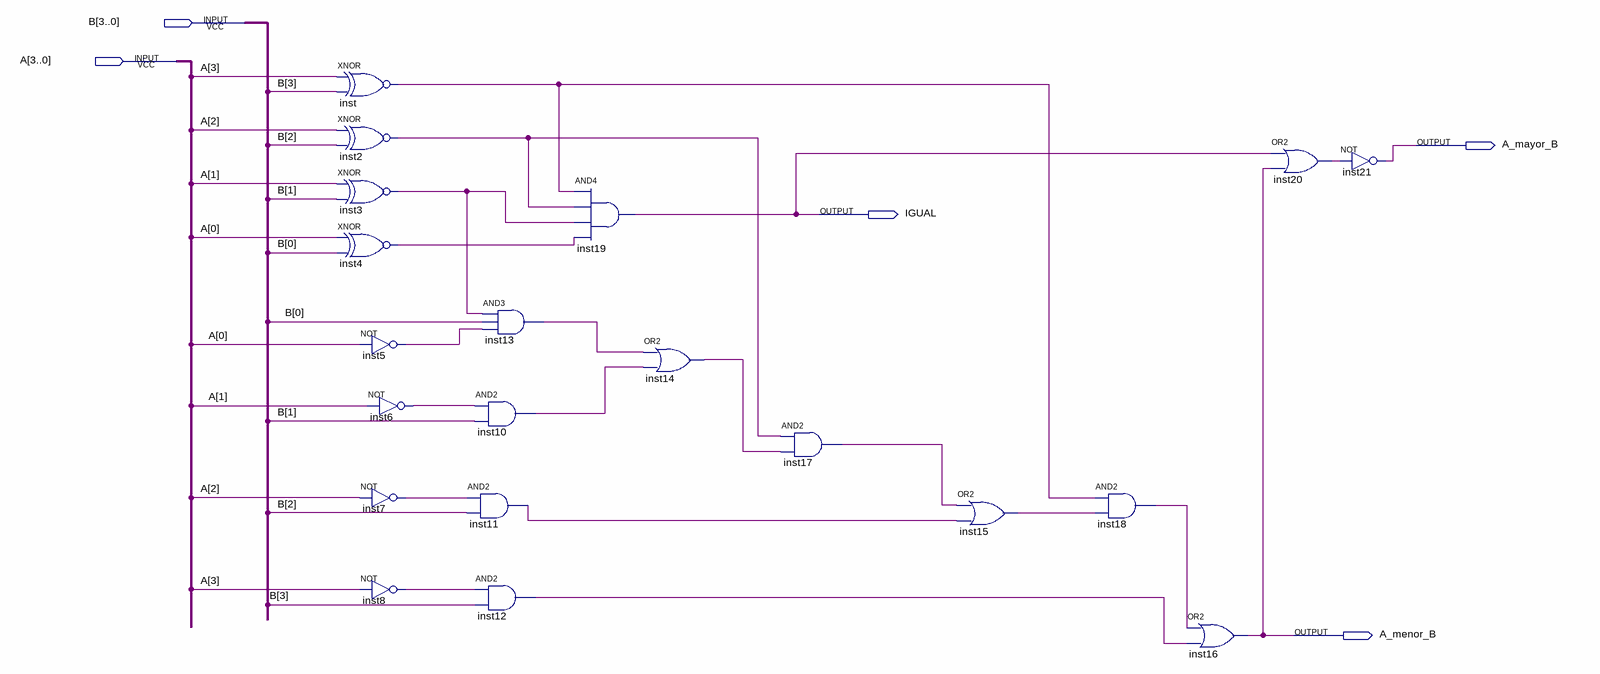
[diagram p0: schematic sheet]
// Quartus schematic Comp_1B.bdf as structural Verilog: 20 symbols, 5 pins
module Comp_1B (
  input  [3:0] B,
  input  [3:0] A,
  output A_mayor_B,
  output IGUAL,
  output A_menor_B
);

  wire inst2_out, inst3_out, inst4_out, inst5_out, inst6_out, inst7_out, inst8_out, inst10_out, inst11_out,
       inst12_out, inst13_out, inst14_out, inst15_out, inst17_out, inst18_out, inst20_out, inst_out;

  xnor inst (inst_out, A[3], B[3]);
  xnor inst2 (inst2_out, A[2], B[2]);
  xnor inst3 (inst3_out, A[1], B[1]);
  xnor inst4 (inst4_out, A[0], B[0]);
  not inst5 (inst5_out, A[0]);
  not inst6 (inst6_out, A[1]);
  not inst7 (inst7_out, A[2]);
  not inst8 (inst8_out, A[3]);
  and inst10 (inst10_out, inst6_out, B[1]);
  and inst11 (inst11_out, inst7_out, B[2]);
  and inst12 (inst12_out, inst8_out, B[3]);
  and inst13 (inst13_out, inst3_out, B[0], inst5_out);
  and inst19 (IGUAL, inst_out, inst2_out, inst3_out, inst4_out);
  or inst14 (inst14_out, inst13_out, inst10_out);
  and inst17 (inst17_out, inst2_out, inst14_out);
  or inst15 (inst15_out, inst17_out, inst11_out);
  and inst18 (inst18_out, inst_out, inst15_out);
  or inst16 (A_menor_B, inst18_out, inst12_out);
  or inst20 (inst20_out, IGUAL, A_menor_B);
  not inst21 (A_mayor_B, inst20_out);
endmodule
